# Altium schematic sheet 425AK01A_S06.SchDoc
size A3; DocumentNumber: 6; SheetNumber: 6; SheetTotal: 10; PageSetup: Record=PageOptions|CenterHorizontal=True|CenterVertical=True|PrintScale=1.01|XCorrection=1.00|YCorrection=1.00|PrintKind=1|BorderSize=5000000|LeftOffset=0|BottomOffset=0|Orientation=2|PaperLength=1000|PaperWidth=1000|Scale=100|PaperSource=15|PrintQuality=600|MediaType=1|DitherType=10|PaperKind=A3|PrintScaleMode=1; 00_Drawn: RJG; 00_Date: 8APR2022; 00_Checked: SR; 00_Approved: GN; 00_Line1: RSB B 10MHz/50MHz Input Paths
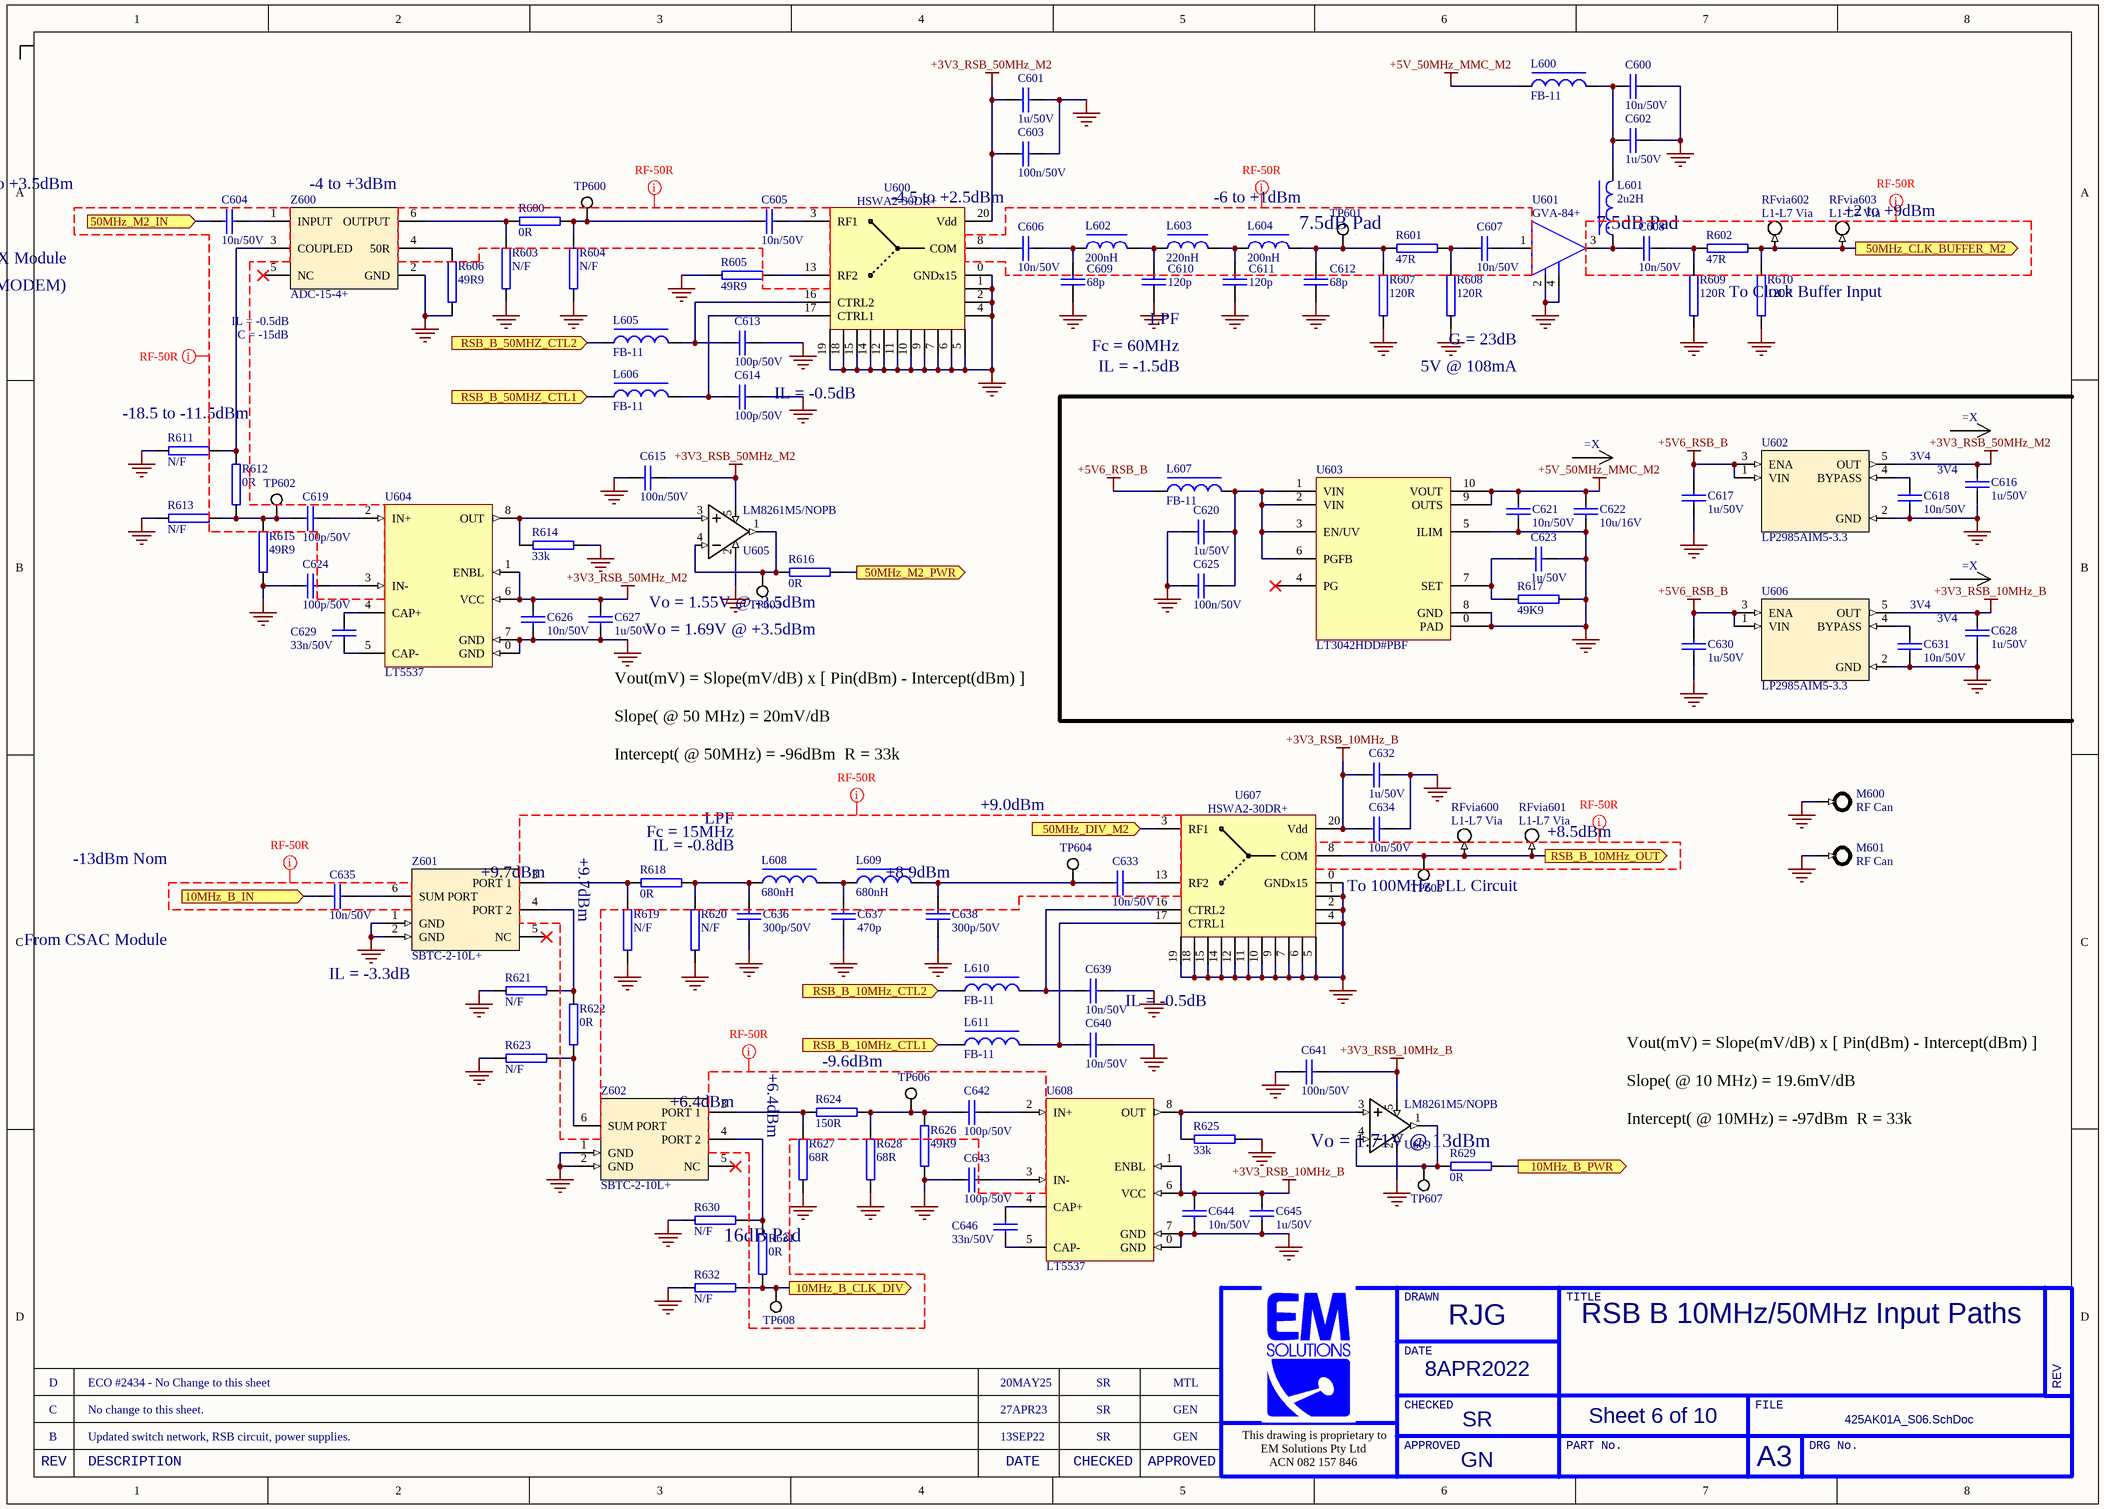
[diagram p0: 425AK01A_S06.SchDoc]

## Parts
(Parts that share a designator on the sheet are numbered #1, #2 ... from top to bottom, then left to right.)
C600  10n/50V  [0402C]
C601  1u/50V  [0603C]
C602  1u/50V  [0603C]
C603  100n/50V  [0402C]
C604  10n/50V  [0402C]
C605  10n/50V  [0402C]
C606  10n/50V  [0402C]
C607  10n/50V  [0402C]
C608  10n/50V  [0402C]
C609  68p  [0402C]
C610  120p  [0402C]
C611  120p  [0402C]
C612  68p  [0402C]
C613  100p/50V  [0402C]
C614  100p/50V  [0402C]
C615  100n/50V  [0402C]
C616  1u/50V  [0603C]
C617  1u/50V  [0603C]
C618  10n/50V  [0402C]
C619  100p/50V  [0402C]
C620  1u/50V  [0603C]
C621  10n/50V  [0402C]
C622  10u/16V  [0805C]
C623  1u/50V  [0603C]
C624  100p/50V  [0402C]
C625  100n/50V  [0402C]
C626  10n/50V  [0402C]
C627  1u/50V  [0603C]
C628  1u/50V  [0603C]
C629  33n/50V  [0402C]
C630  1u/50V  [0603C]
C631  10n/50V  [0402C]
C632  1u/50V  [0603C]
C633  10n/50V  [0402C]
C634  10n/50V  [0402C]
C635  10n/50V  [0402C]
C636  300p/50V  [0402C]
C637  470p  [0402C]
C638  300p/50V  [0402C]
C639  10n/50V  [0402C]
C640  10n/50V  [0402C]
C641  100n/50V  [0402C]
C642  100p/50V  [0402C]
C643  100p/50V  [0402C]
C644  10n/50V  [0402C]
C645  1u/50V  [0603C]
C646  33n/50V  [0402C]
GA?#1  13mA  (value not drawn)  (graphical)
GA?#2  108mA  (value not drawn)  (graphical)
GA?#3  13mA  (value not drawn)  (graphical)
L600  FB-11  [0402L]
L601  2u2H  [0805L]
L602  200nH  [0402L]
L603  220nH  [0402L]
L604  200nH  [0402L]
L605  FB-11  [0402L]
L606  FB-11  [0402L]
L607  FB-11  [0402L]
L608  680nH  [0603L]
L609  680nH  [0603L]
L610  FB-11  [0402L]
L611  FB-11  [0402L]
M600  RF Can  [Can_38x25.4x6mm]
M601  RF Can  [Can_38x25.4x6mm]
R600  0R  [0402]
R601  47R  [0402]
R602  47R  [0402]
R603  N/F  [0402]
R604  N/F  [0402]
R605  49R9  [0402]
R606  49R9  [0402]
R607  120R  [0402]
R608  120R  [0402]
R609  120R  [0402]
R610  120R  [0402]
R611  N/F  [0402]
R612  0R  [0402]
R613  N/F  [0402]
R614  33k  [0402]
R615  49R9  [0402]
R616  0R  [0402]
R617  49K9  [0402]
R618  0R  [0402]
R619  N/F  [0402]
R620  N/F  [0402]
R621  N/F  [0402]
R622  0R  [0402]
R623  N/F  [0402]
R624  150R  [0402]
R625  33k  [0402]
R626  49R9  [0402]
R627  68R  [0402]
R628  68R  [0402]
R629  0R  [0402]
R630  N/F  [0402]
R631  0R  [0402]
R632  N/F  [0402]
RFvia600  L1-L7 Via  [RFvia_L1-L7]  (no BOM)
RFvia601  L1-L7 Via  [RFvia_L1-L7]  (no BOM)
RFvia602  L1-L7 Via  [RFvia_L1-L7]  (no BOM)
RFvia603  L1-L7 Via  [RFvia_L1-L7]  (no BOM)
TP600  Pad  [Testpoint-0.5mm-SMT-withPaste]  (value not drawn)  (no BOM)
TP601  Pad  [Testpoint-0.5mm-SMT-withPaste]  (value not drawn)  (no BOM)
TP602  Pad  [Testpoint-0.5mm-SMT-withPaste]  (value not drawn)  (no BOM)
TP603  Pad  [Testpoint-0.5mm-SMT-withPaste]  (value not drawn)  (no BOM)
TP604  Pad  [Testpoint-0.5mm-SMT-withPaste]  (value not drawn)  (no BOM)
TP605  Pad  [Testpoint-0.5mm-SMT-withPaste]  (value not drawn)  (no BOM)
TP606  Pad  [Testpoint-0.5mm-SMT-withPaste]  (value not drawn)  (no BOM)
TP607  Pad  [Testpoint-0.5mm-SMT-withPaste]  (value not drawn)  (no BOM)
TP608  Pad  [Testpoint-0.5mm-SMT-withPaste]  (value not drawn)  (no BOM)
U600  HSWA2-30DR+  [DG983-1]
U601  GVA-84+  [SOT-89-RF]
U602  LP2985AIM5-3.3  [SOT-23/5]
U603  LT3042HDD#PBF  [DFN50P300X300X80_HS-11N]
U604  LT5537  [DFN-8]
U605  LM8261M5/NOPB  [SOT-23/5]
U606  LP2985AIM5-3.3  [SOT-23/5]
U607  HSWA2-30DR+  [DG983-1]
U608  LT5537  [DFN-8]
U609  LM8261M5/NOPB  [SOT-23/5]
Z600  ADC-15-4+  [ADC-15-4+]
Z601  SBTC-2-10L+  [SBTC-2-10L+]
Z602  SBTC-2-10L+  [SBTC-2-10L+]

## Ports
10MHz_B_CLK_DIV (out), 10MHz_B_IN (in), 10MHz_B_PWR (out), 50MHz_CLK_BUFFER_M2 (out), 50MHz_DIV_M2 (in), 50MHz_M2_IN (in), 50MHz_M2_PWR (out), RSB_B_10MHz_CTL1 (in), RSB_B_10MHz_CTL2 (in), RSB_B_10MHz_OUT (out), RSB_B_50MHZ_CTL1 (in), RSB_B_50MHZ_CTL2 (in)

## Nets
+3V3_RSB_10MHz_B: C628.2 C632.1 C634.1 C641.2 C644.1 C645.2 U606.5(OUT) U607.20(Vdd) U608.1(ENBL) U608.6(VCC) U609.5(V+)
+3V3_RSB_50MHz_M2: C601.1 C603.1 C615.2 C616.2 C626.1 C627.2 U600.20(Vdd) U602.5(OUT) U604.1(ENBL) U604.6(VCC) U605.5(V+)
+5V6_RSB_B: C617.2 C630.2 L607.2 U602.1(VIN) U602.3(ENA) U606.1(VIN) U606.3(ENA)
+5V_50MHz_MMC_M2: C621.2 C622.1 L600.1 U603.9(OUTS) U603.10(VOUT)
GND: C600.2 C601.2 C602.1 C603.2 C609.1 C610.1 C611.1 C612.1 C613.2 C614.2 C615.1 C616.1 C617.1 C618.1 C620.1 C621.1 C622.2 C623.2 C624.1 C625.2 C626.2 C627.1 C628.1 C630.1 C631.1 C632.2 C634.2 C636.2 C637.2 C638.2 C639.2 C640.2 C641.1 C643.1 C644.2 C645.1 M600.0 M601.0 R603.2 R604.2 R605.1 R606.1 R607.2 R608.2 R609.2 R610.2 R611.2 R613.2 R614.1 R615.1 R617.1 R619.2 R620.2 R621.2 R623.2 R625.1 R626.1 R627.2 R628.2 R630.2 R632.2 U600.0(GNDx15) U600.1(GND) U600.2(GND) U600.4(GND) U600.5(GND) U600.6(GND) U600.7(GND) U600.9(GND) U600.10(GND) U600.11(GND) U600.12(GND) U600.14(GND) U600.15(GND) U600.18(GND) U600.19(GND) U601.2 U601.4 U602.2(GND) U603.0(PAD) U603.5(ILIM) U603.8(GND) U604.0(GND) U604.7(GND) U605.2(V-) U606.2(GND) U607.0(GNDx15) U607.1(GND) U607.2(GND) U607.4(GND) U607.5(GND) U607.6(GND) U607.7(GND) U607.9(GND) U607.10(GND) U607.11(GND) U607.12(GND) U607.14(GND) U607.15(GND) U607.18(GND) U607.19(GND) U608.0(GND) U608.7(GND) U609.2(V-) Z600.2(GND) Z601.1(GND) Z601.2(GND) Z602.1(GND) Z602.2(GND)
10MHz_B_CLK_DIV: R631.1 R632.1 TP608.1 ; port 10MHz_B_CLK_DIV
10MHz_B_IN: C635.1 ; port 10MHz_B_IN
10MHz_B_PWR: R629.1 ; port 10MHz_B_PWR
50MHz_CLK_BUFFER_M2: R602.1 R610.1 RFvia602.1 RFvia603.1 ; port 50MHz_CLK_BUFFER_M2
50MHz_DIV_M2: U607.3(RF1) ; port 50MHz_DIV_M2
50MHz_M2_IN: C604.2 ; port 50MHz_M2_IN
50MHz_M2_PWR: R616.1 ; port 50MHz_M2_PWR
RSB_B_10MHz_CTL1: L611.2 ; port RSB_B_10MHz_CTL1
RSB_B_10MHz_CTL2: L610.2 ; port RSB_B_10MHz_CTL2
RSB_B_10MHz_OUT: RFvia600.1 RFvia601.1 TP605.1 U607.8(COM) ; port RSB_B_10MHz_OUT
RSB_B_50MHZ_CTL1: L606.2 ; port RSB_B_50MHZ_CTL1
RSB_B_50MHZ_CTL2: L605.2 ; port RSB_B_50MHZ_CTL2
NetC600_1: C600.1 C602.2 L600.2 L601.2
NetC604_1: C604.1 Z600.1(INPUT)
NetC605_1: C605.1 R600.1 R604.1 TP600.1
NetC605_2: C605.2 U600.3(RF1)
NetC606_1: C606.1 C609.2 L602.1
NetC606_2: C606.2 U600.8(COM)
NetC607_1: C607.1 R601.1 R608.1
NetC607_2: C607.2 U601.1
NetC608_1: C608.1 L601.1 U601.3
NetC608_2: C608.2 R602.2 R609.1
NetC610_2: C610.2 L602.2 L603.1
NetC611_2: C611.2 L603.2 L604.1
NetC612_2: C612.2 L604.2 R601.2 R607.1 TP601.1
NetC613_1: C613.1 L605.1 U600.16(CTRL2)
NetC614_1: C614.1 L606.1 U600.17(CTRL1)
NetC618_2: C618.2 U602.4(BYPASS)
NetC619_1: C619.1 R612.1 R613.1 R615.2 TP602.1
NetC619_2: C619.2 U604.2(IN+)
NetC620_2: C620.2 C625.1 L607.1 U603.1(VIN) U603.2(VIN) U603.3(EN/UV) U603.6(PGFB)
NetC623_1: C623.1 R617.2 U603.7(SET)
NetC624_2: C624.2 U604.3(IN-)
NetC629_1: C629.1 U604.5(CAP-)
NetC629_2: C629.2 U604.4(CAP+)
NetC631_2: C631.2 U606.4(BYPASS)
NetC633_1: C633.1 U607.13(RF2)
NetC633_2: C633.2 C638.1 L609.2 TP604.1
NetC635_2: C635.2 Z601.6(SUM_PORT)
NetC636_1: C636.1 L608.1 R618.1 R620.1
NetC637_1: C637.1 L608.2 L609.1
NetC639_1: C639.1 L610.1 U607.16(CTRL2)
NetC640_1: C640.1 L611.1 U607.17(CTRL1)
NetC642_1: C642.1 R624.1 R626.2 R628.1 TP606.1
NetC642_2: C642.2 U608.2(IN+)
NetC643_2: C643.2 U608.3(IN-)
NetC646_1: C646.1 U608.5(CAP-)
NetC646_2: C646.2 U608.4(CAP+)
NetR600_2: R600.2 R603.1 Z600.6(OUTPUT)
NetR605_2: R605.2 U600.13(RF2)
NetR606_2: R606.2 Z600.4(50R)
NetR611_1: R611.1 R612.2 Z600.3(COUPLED)
NetR614_2: R614.2 U604.8(OUT) U605.3(IN+)
NetR616_2: R616.2 TP603.1 U605.1(OUT) U605.4(IN-)
NetR618_2: R618.2 R619.1 Z601.3(PORT_1)
NetR621_1: R621.1 R622.2 Z601.4(PORT_2)
NetR622_1: R622.1 R623.1 Z602.6(SUM_PORT)
NetR624_2: R624.2 R627.1 Z602.3(PORT_1)
NetR625_2: R625.2 U608.8(OUT) U609.3(IN+)
NetR629_2: R629.2 TP607.1 U609.1(OUT) U609.4(IN-)
NetR630_1: R630.1 R631.2 Z602.4(PORT_2)

Not connected (* = marked no-connect by the designer): U603 4(PG)*; Z600 5(NC)*; Z601 5(NC)*; Z602 5(NC)*

## Layout directives
net class RF-50R: (no net found under the mark)

## Notes on the sheet
- (near C604) -3.5 to +3.5dBm
- -4 to +3dBm
- -4.5 to +2.5dBm
- -6 to +1dBm
- 7.5dB Pad
- +2 to +9dBm
- (near C604) From TX Module
- (GX MODEM)
- To Clock Buffer Input
- (near Z600) IL = -0.5dB
- C = -15dB
- LPF
- Fc = 60MHz
- IL = -1.5dB
- G = 23dB
- 5V @ 108mA
- -18.5 to -11.5dBm
- IL = -0.5dB
- 3V4
- (near R616) Vo = 1.55V @ -3.5dBm
- Vo = 1.69V @ +3.5dBm
- (near C627) Vout(mV) = Slope(mV/dB) x [ Pin(dBm) - Intercept(dBm) ]
  Slope( @ 50 MHz) = 20mV/dB
  Intercept( @ 50MHz) = -96dBm  R = 33k
- Fc = 15MHz
- IL = -0.8dB
- +9.0dBm
- +8.5dBm
- -13dBm Nom
- +9.7dBm
- +8.9dBm
- (near RFvia601) To 100MHz PLL Circuit
- (near C635) From CSAC Module
- (near R621) IL = -3.3dB
- +6.4dBm
- -9.6dBm
- Vout(mV) = Slope(mV/dB) x [ Pin(dBm) - Intercept(dBm) ]
  Slope( @ 10 MHz) = 19.6mV/dB
  Intercept( @ 10MHz) = -97dBm  R = 33k
- (near R629) Vo = 1.71V @ 13dBm
- 16dB Pad
- D
- ECO #2434 - No Change to this sheet
- 20MAY25
- SR
- MTL
- B
- C
- Updated switch network, RSB circuit, power supplies.
- No change to this sheet.
- 13SEP22
- 27APR23
- GEN
- DRAWN
- TITLE
- DATE
- REV
- This drawing is proprietary to
- EM Solutions Pty Ltd
- APPROVED
- CHECKED
- PART No.
- FILE
- A3
- DRG No.
- DESCRIPTION
- ACN 082 157 846

## Library data of the parts
C600 C607 C608 C626 C644 = 41-010N-12: Capacitor, 0402, 10n X7R 10% 50V Ceramic, NiSn; MANUFACTURER: MURATA; MODELNAME: GCM155R71H103KA55D; ID: 2217; Part Number: 41-010N-12; ItemID: 41-010N-12
C601 C602 C627 C632 C645 = 41-01U0-06: Capacitor, 0603, 1u X7R 10% 50V Ceramic, NiSn; MANUFACTURER: TAIYOYUDEN; ID: 2287; MODELNAME: UMK107AB7105KA; Part Number: 41-01U0-06; ItemID: 41-01U0-06
C603 C615 C625 C641 = 41-100N-13: Capacitor, 0402, 100n, X7R, 10% 50V, Ceramic; MANUFACTURER: MURATA; ID: 2441; MODELNAME: GRM155R71H104KE14J; Part Number: 41-100N-13; ItemID: 41-100N-13
C604-C606 C618 C621 C631 C633-C635 C639 C640 = 41-010N-12: Capacitor, 0402, 10n X7R 10% 50V Ceramic, NiSn; MANUFACTURER: MURATA; ID: 2217; MODELNAME: GCM155R71H103KA55D; Part Number: 41-010N-12; ItemID: 41-010N-12
C609 C612 = 41-068P-08: Capacitor, 0402, 68p; Part Number: 41-068P-08
C610 C611 = 41-120P-05: Capacitor, 0402, 120p NPO; Part Number: 41-120P-05
C613 C614 C619 C624 C642 C643 = 41-100P-11: Capacitor, 0402, 100p NPO 5% 50V Ceramic, AEC-Q200; MANUFACTURER: TDK; ID: 2448; MODELNAME: CGA2B2C0G1H101J050BA; Part Number: 41-100P-11; ItemID: 41-100P-11
C616 C617 C620 C623 C628 C630 = 41-01U0-06: Capacitor, 0603, 1u X7R 10% 50V Ceramic, NiSn; MANUFACTURER: TAIYOYUDEN; MODELNAME: UMK107AB7105KA; ID: 2287; Part Number: 41-01U0-06; ItemID: 41-01U0-06
C622 = 41-010U-08: Capacitor, 0805, 10u X7R 10% 16V Ceramic, NiSn; MANUFACTURER: SAMSUNG; ID: 2232; MODELNAME: CL21B106KOQNNNE; Part Number: 41-010U-08; ItemID: 41-010U-08
C629 C646 = 41-033N-01: *Capacitor, 0402, 33n, X7R, 10%, 50V; Part Number: 41-033N-01
C636 C638 = 41-300P-01: Capacitor, 0402, 300p NPO 5% 50V Ceramic, NiSn; MANUFACTURER: MURATA; ID: 2478; MODELNAME: GRM1555C1H301JA01D; Part Number: 41-300P-01; ItemID: 41-300P-01
C637 = 41-470P-08: Capacitor, 0402, 470p ,NPO. 5% 50V Ceramic, NiSn; MANUFACTURER: MURATA; ID: 2499; MODELNAME: GRM1555C1H471JA01D; Part Number: 41-470P-08; ItemID: 41-470P-08
GA?#1-GA?#3 = Graphical-Current-Arrow
  GA?#1 GA?#3: X: 13mA
  GA?#2: X: 108mA
L600 = 46-B-11: Solid Inductor, 600ohm@100MHz, DCR=0.52, 0.3A, 0402 size; MANUFACTURER: TDK; ID: 3256; MODELNAME: MMZ1608B301CTAH0; Part Number: 46-B-11; ItemID: 46-B-11
L601 = 46-02U2-01: Inductor, Chip, 2u2H 10%, 0805, SIMID08B Series; MANUFACTURER: SIEMENS; MODELNAME: B82498-B3222-K; Part Number: 46-02U2-01; Category: EMS Parts Master
L602 L604 = 46-200N-04: Inductor, Chip, 200nH, 0402; Part Number: 46-200N-04
L603 = 46-220N-05: Inductor, Chip, 220nH, 0402; Part Number: 46-220N-05
L605-L607 L610 L611 = 46-B-11: Solid Inductor, 600ohm@100MHz, DCR=0.52, 0.3A, 0402 size; MANUFACTURER: TDK; MODELNAME: MMZ1005S601C; ID: 3256; Part Number: 46-B-11; ItemID: 46-B-11
L608 L609 = 46-680N-02: Inductor, Chip, 680nH, 2%, 0603, 470mA, SRF=260MHz, 0603LS Series; MANUFACTURER: COILCRAFT; ID: 3246; MODELNAME: 0603LS-681XGLB; Part Number: 46-680N-02; ItemID: 46-680N-02
M600 M601 = Can-RF: Part Number: 11-0256
R600 R612 R616 R618 R622 R629 R631 = 44-000R-10: Resistor, 0402, 0R 1% 0.063W; MANUFACTURER: GENERIC; ID: 2538; Part Number: 44-000R-10; ItemID: 44-000R-10; MODELNAME: GENERIC
R601 R602 = 44-047R-10: Resistor, 0402, 47R 1% 0.063W; ID: 2786; Part Number: 44-047R-10; ItemID: 44-047R-10
R603 R604 R611 R613 R619-R621 R623 R630 R632 = 44-N/F-10: Resistor, 0402, SOT, Not Fitted; ID: 3111; Part Number: 44-N/F-10; ItemID: 44-N/F-10
R605 R606 R615 R626 = 44-049R9-10: Resistor, 0402, 49R9 1% 0.063W; ID: 2787; MODELNAME: RC0402FR-0749R9L; Part Number: 44-049R9-10; ItemID: 44-049R9-10
R607-R610 = 44-120R-10: Resistor, 0402, 120R 1% 0.063W; MANUFACTURER: GENERIC; ID: 2950; Part Number: 44-120R-10; ItemID: 44-120R-10; MODELNAME: GENERIC
R614 R625 = 44-033K-10: Resistor, 0402, 33k 1% 0.063W; MANUFACTURER: PHILIPS; ID: 2720; MODELNAME: RC32H; Part Number: 44-033K-10; ItemID: 44-033K-10
R617 = 44-49K9-01: Resistor, 0402, 49.9K, 1%, 0.1W, ThickFilm, AEC-Q200; MANUFACTURER: PANASONIC; MODELNAME: ERJ-2RKF4992X; ID: 3061; Part Number: 44-49K9-01; ItemID: 44-49K9-01
R624 = 44-150R-10: Resistor, 0402, 150R 1% 0.063W; MANUFACTURER: GENERIC; ID: 2966; Part Number: 44-150R-10; ItemID: 44-150R-10; MODELNAME: GENERIC
R627 R628 = 44-068R-10: Resistor, 0402, 68R 1% 0.063W; MANUFACTURER: GENERIC; ID: 2849; Part Number: 44-068R-10; ItemID: 44-068R-10; MODELNAME: GENERIC
RFvia600-RFvia603 = RFvia_L1-L7: RF Via from layer 1 to layer 7, on an 8-layer board.; Rule: UNIONINDEX=0|RULEKIND=PlaneClearance|NETSCOPE=AnyNet|LAYERKIND=SameLayer|NAME=Schematic Power Plane Clearance|CLEARANCE=13.7795mil|UNIT=Imperial
TP600-TP608 = Pad: Pad that can be a test point or a hot via
U600 U607 = HSWA2-30DR+: RF Switch, SPDT, DC-3GHz, Absorptive, IL=1dB, I=60dB, P=30dBm, 2V7-3V3, 4x4 QFN; MANUFACTURER: MINICCTS; ID: 3484; Part Number: 54-30-01; MODELNAME: HSWA2-30DR+; ItemID: 54-30-01
U601 = GVA-84+: MMIC, DC-7GHz, G=24dB, P1dB=20.5dBm, SOT-89; Part Number: 58-GVA84-01
U602 U606 = Regulator-Linear-3V3-LP2985: Volt Regulator, 3.3V, 150mA, LoNoise, LDO, SOT-23/5; Part Number: 52-2985-06; MPN: LP2985AIM5-3.3/NOPB; Manufacturer: Texas Instruments
U603 = 52-3042-01: Volt Regulator, Vin=1.8-20V, Vin=0-15V, 200mA, Low Noise, -40to+125C; MANUFACTURER: ANLG DEV; MODELNAME: LT3042IDD#PBF; ID: 3361; Part Number: 52-3042-01; ItemID: 52-3042-01
U604 U608 = LT5537EDDB: RF Detector, 10-1000MHz, 83dB, -40/+85C, 8-DFN 3x2mm; Part Number: 54-5537-01; MPN: LT5537EDDB
U605 U609 = OpAmp-LM8261: Opamp, RRIO, 2V5 to 30V supply, 21MHz GBWP; Part Number: 52-8621-01
Z600 = 33-0058: Directional Coupler, C=15.5dB, 5-1000MHz, SM; MANUFACTURER: MINICCTS; ID: 2077; Part Number: 33-0058; MODELNAME: ADC-15-4+; ItemID: 33-0058
Z601 Z602 = 33-0055: Divider/Combiner, 2 Way, 0 deg, 10 -1000MHz, Tx Line Tranformer; MANUFACTURER: MINICCTS; ID: 2075; Part Number: 33-0055; ItemID: 33-0055; MODELNAME: SBTC-2-10L+